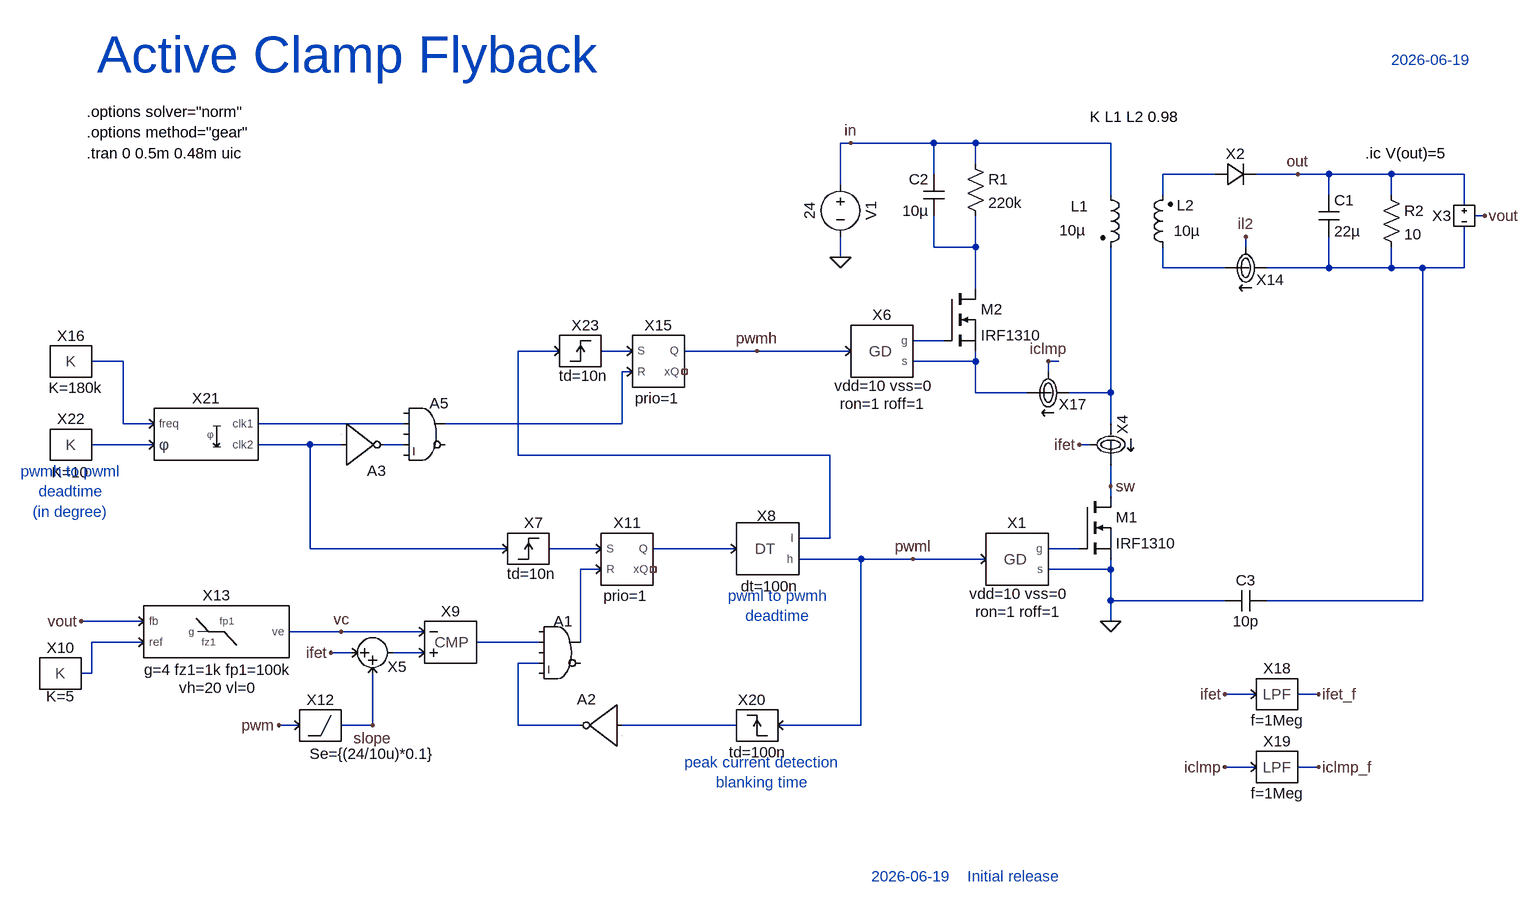
[diagram p0: schematic FLYBACK_ACTIVECLAMP.asc]
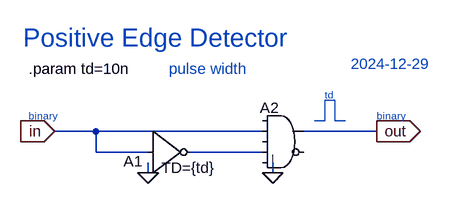
[diagram p1: sub-circuit posedge.asc]
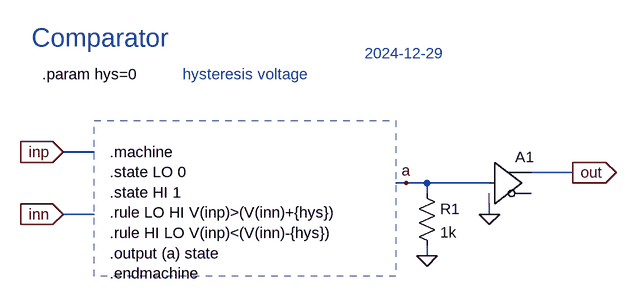
[diagram p2: sub-circuit cmp.asc]
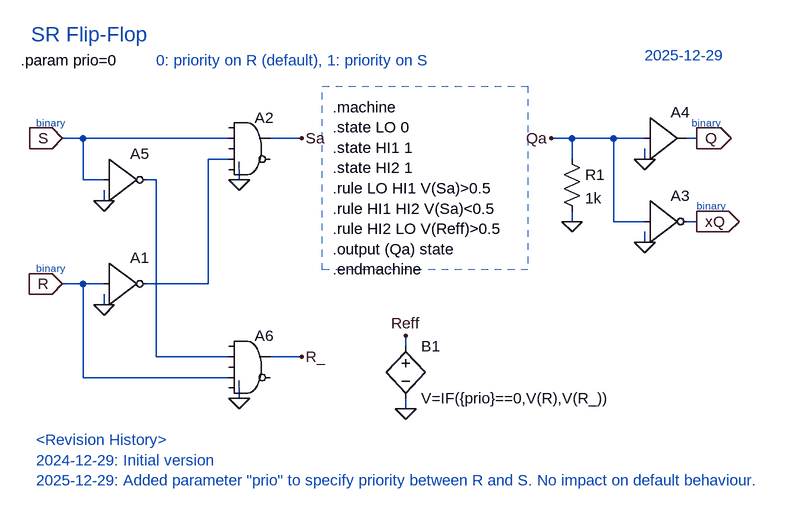
[diagram p3: sub-circuit srff.asc]
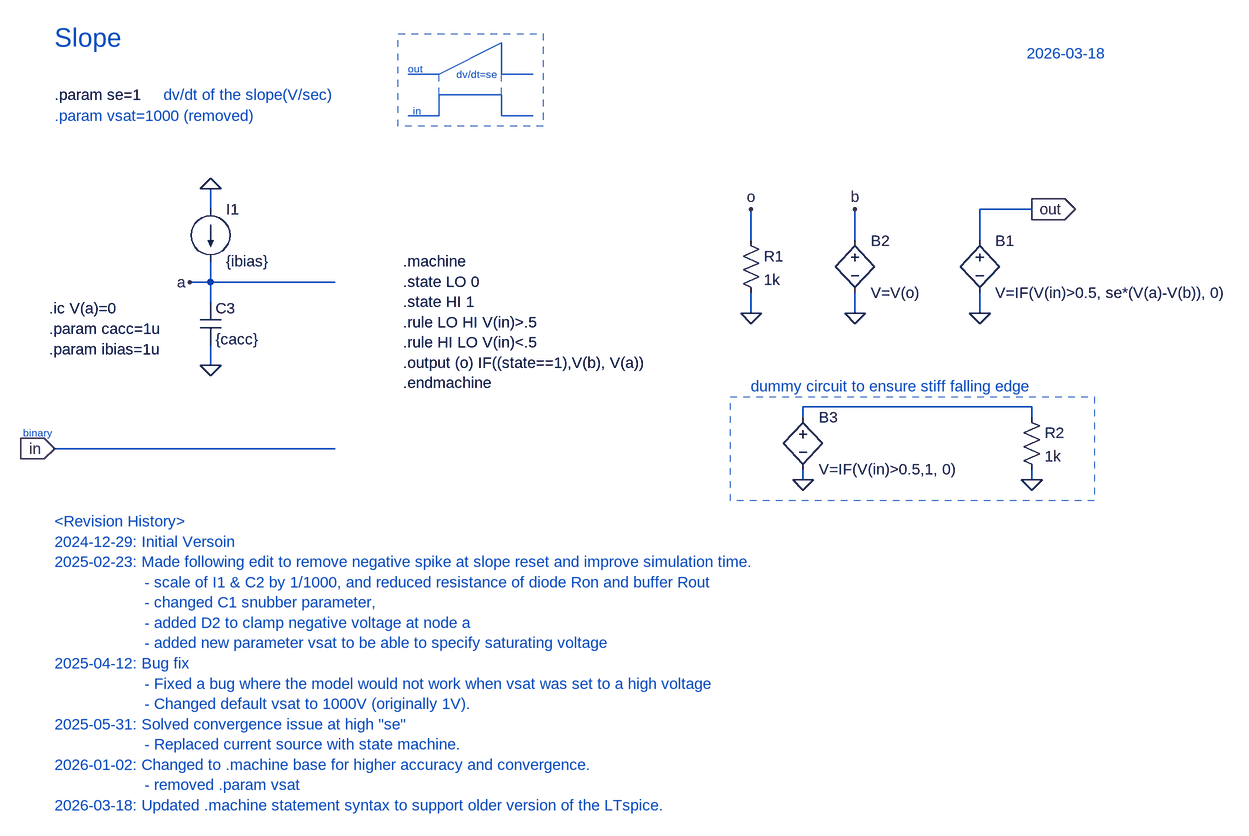
[diagram p4: sub-circuit slope.asc]
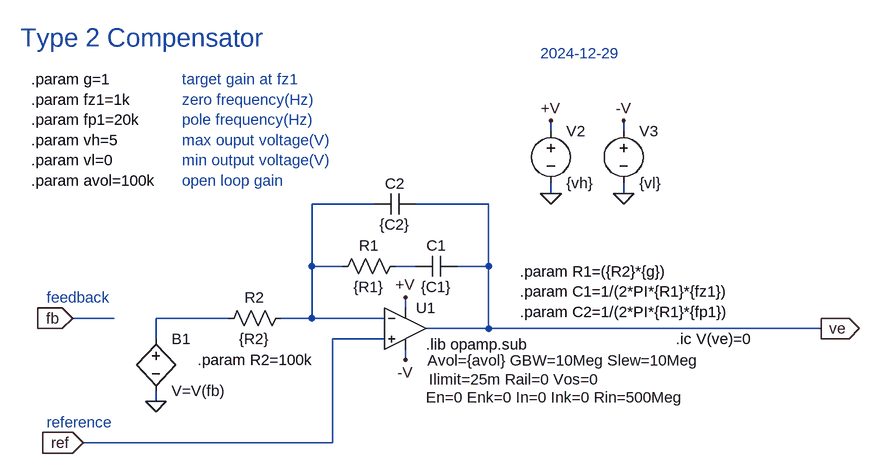
[diagram p5: sub-circuit type2.asc]
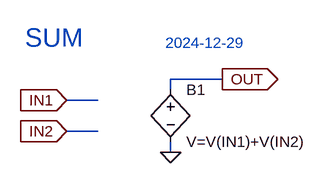
[diagram p6: sub-circuit sum.asc]
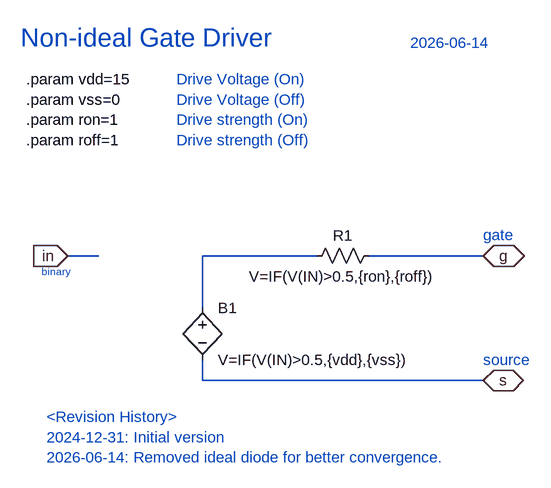
[diagram p7: sub-circuit gd.asc]
FLYBACK_ACTIVECLAMP.asc, the LTspice schematic file:
Version 4.1
SHEET 1 1716 1312
WIRE 608 -352 592 -352
WIRE 736 -352 608 -352
WIRE 800 -352 736 -352
WIRE 1008 -352 800 -352
WIRE 800 -320 800 -352
WIRE 736 -304 736 -352
WIRE 1168 -304 1088 -304
WIRE 1296 -304 1232 -304
WIRE 1344 -304 1296 -304
WIRE 1440 -304 1344 -304
WIRE 1552 -304 1440 -304
WIRE 592 -288 592 -352
WIRE 1008 -272 1008 -352
WIRE 1088 -272 1088 -304
WIRE 1344 -272 1344 -304
WIRE 1440 -272 1440 -304
WIRE 1552 -256 1552 -304
WIRE 1584 -240 1568 -240
WIRE 736 -192 736 -240
WIRE 800 -192 800 -240
WIRE 800 -192 736 -192
WIRE 1216 -192 1216 -208
WIRE 592 -176 592 -208
WIRE 1088 -160 1088 -192
WIRE 1184 -160 1088 -160
WIRE 1344 -160 1344 -208
WIRE 1344 -160 1248 -160
WIRE 1440 -160 1440 -192
WIRE 1440 -160 1344 -160
WIRE 1488 -160 1440 -160
WIRE 1552 -160 1552 -224
WIRE 1552 -160 1488 -160
WIRE 800 -128 800 -192
WIRE 752 -48 704 -48
WIRE 160 -32 96 -32
WIRE 272 -32 224 -32
WIRE 464 -32 352 -32
WIRE 608 -32 464 -32
WIRE -512 -16 -560 -16
WIRE 800 -16 800 -32
WIRE 800 -16 704 -16
WIRE 928 -16 912 -16
WIRE 272 0 256 0
WIRE 912 0 912 -16
WIRE 800 32 800 -16
WIRE 880 32 800 32
WIRE 1008 32 1008 -192
WIRE 1008 32 944 32
WIRE -512 80 -512 -16
WIRE -464 80 -512 80
WIRE -80 80 -304 80
WIRE 256 80 256 0
WIRE 256 80 -16 80
WIRE 1008 80 1008 32
WIRE -464 112 -560 112
WIRE -224 112 -304 112
WIRE -176 112 -224 112
WIRE -80 112 -112 112
WIRE 976 112 960 112
WIRE 96 128 96 -32
WIRE 576 128 96 128
WIRE 1008 176 1008 144
WIRE 1008 192 1008 176
WIRE 576 256 576 128
WIRE 576 256 528 256
WIRE -224 272 -224 112
WIRE 80 272 -224 272
WIRE 224 272 144 272
WIRE 432 272 304 272
WIRE 960 272 912 272
WIRE 624 288 528 288
WIRE 704 288 624 288
WIRE 816 288 704 288
WIRE 224 304 192 304
WIRE 1008 304 1008 288
WIRE 1008 304 912 304
WIRE 1008 352 1008 304
WIRE 1184 352 1008 352
WIRE 1488 352 1488 -160
WIRE 1488 352 1248 352
WIRE -480 384 -576 384
WIRE 1008 384 1008 352
WIRE -176 400 -256 400
WIRE -48 400 -176 400
WIRE -480 416 -560 416
WIRE 128 416 32 416
WIRE 192 416 192 304
WIRE -160 432 -192 432
WIRE -48 432 -96 432
WIRE 128 448 96 448
WIRE -560 464 -560 416
WIRE -560 464 -576 464
WIRE 1232 496 1184 496
WIRE 1328 496 1296 496
WIRE -240 544 -272 544
WIRE -128 544 -128 464
WIRE -128 544 -176 544
WIRE 96 544 96 448
WIRE 192 544 96 544
WIRE 432 544 256 544
WIRE 624 544 624 288
WIRE 624 544 496 544
WIRE 1232 608 1184 608
WIRE 1328 608 1296 608
FLAG 592 -176 0
FLAG 1008 176 sw
FLAG -176 400 vc
FLAG -272 544 pwm
FLAG -128 544 slope
FLAG 608 -352 in
FLAG 1008 384 0
FLAG 960 112 ifet
FLAG 1296 -304 out
FLAG 1584 -240 vout
FLAG -576 384 vout
FLAG -192 432 ifet
FLAG 1216 -208 il2
FLAG 912 -16 iclmp
FLAG 1184 496 ifet
FLAG 1328 496 ifet_f
FLAG 1184 608 iclmp
FLAG 1328 608 iclmp_f
FLAG 464 -32 pwmh
FLAG 704 288 pwml
SYMBOL voltage 592 -304 R0
WINDOW 0 32 56 VTop 2
WINDOW 3 -32 56 VBottom 2
WINDOW 123 0 0 Left 0
WINDOW 39 0 0 Left 0
SYMATTR InstName V1
SYMATTR Value 24
SYMBOL ind2 992 -288 R0
WINDOW 0 -45 33 Left 2
WINDOW 3 -63 70 Left 2
SYMATTR InstName L1
SYMATTR Value 10µ
SYMATTR SpiceLine Rser=10m
SYMATTR Type ind
SYMBOL IMON 1008 112 R90
SYMATTR InstName X4
SYMBOL POSEDGE 112 272 R0
WINDOW 39 5 54 Bottom 2
SYMATTR InstName X7
SYMBOL CMP 0 416 R0
SYMATTR InstName X9
SYMBOL SRFF 256 288 R0
WINDOW 39 6 72 Bottom 2
SYMATTR SpiceLine prio=1
SYMATTR InstName X11
SYMBOL SLOPE -208 544 R0
WINDOW 39 80 59 Bottom 2
SYMATTR SpiceLine Se={(24/10u)*0.1}
SYMATTR InstName X12
SYMBOL TYPE2 -368 400 R0
WINDOW 0 0 -56 Center 2
WINDOW 39 2 58 Center 2
WINDOW 40 2 86 Center 2
SYMATTR InstName X13
SYMATTR SpiceLine g=4 fz1=1k fp1=100k
SYMATTR SpiceLine2 vh=20 vl=0
SYMBOL CONST -608 464 R0
WINDOW 39 0 51 Bottom 2
SYMATTR SpiceLine K=5
SYMATTR InstName X10
SYMBOL SUM -128 432 R0
WINDOW 0 38 37 Bottom 2
SYMATTR InstName X5
SYMBOL PowerSim\\GD 864 288 R0
WINDOW 39 2 69 Bottom 2
WINDOW 40 2 97 Bottom 2
SYMATTR SpiceLine vdd=10 vss=0
SYMATTR InstName X1
SYMBOL nmos 960 192 R0
SYMATTR InstName M1
SYMATTR Value IRF1310
SYMBOL res 784 -336 R0
SYMATTR InstName R1
SYMATTR Value 220k
SYMBOL ind2 1104 -176 R180
WINDOW 0 -33 80 Left 2
WINDOW 3 -42 41 Left 2
SYMATTR InstName L2
SYMATTR Value 10µ
SYMATTR SpiceLine Rser=10m
SYMATTR Type ind
SYMBOL PowerSim\\iD 1200 -304 R270
WINDOW 0 16 0 VTop 2
SYMATTR InstName X2
SYMBOL cap 1328 -272 R0
SYMATTR InstName C1
SYMATTR Value 22µ
SYMATTR SpiceLine Rser=1m
SYMBOL res 1424 -288 R0
SYMATTR InstName R2
SYMATTR Value 10
SYMBOL PowerSim\\VMON 1552 -240 R0
SYMATTR InstName X3
SYMBOL cap 752 -304 M0
SYMATTR InstName C2
SYMATTR Value 10µ
SYMATTR SpiceLine Rser=1m
SYMBOL IMON 1216 -160 R180
SYMATTR InstName X14
SYMBOL cap 1248 336 R90
WINDOW 0 0 32 VBottom 2
WINDOW 3 32 32 VTop 2
SYMATTR InstName C3
SYMATTR Value 10p
SYMBOL PowerSim\\GD 656 -32 R0
WINDOW 39 2 69 Bottom 2
WINDOW 40 2 97 Bottom 2
SYMATTR SpiceLine vdd=10 vss=0
SYMATTR InstName X6
SYMBOL IMON 912 32 R180
SYMATTR InstName X17
SYMBOL PowerSim\\LPF 1264 496 R0
WINDOW 3 1 56 Bottom 2
SYMATTR Value f=1Meg
SYMATTR InstName X18
SYMBOL PowerSim\\LPF 1264 608 R0
WINDOW 3 1 56 Bottom 2
SYMATTR Value f=1Meg
SYMATTR InstName X19
SYMBOL POSEDGE 464 544 M0
WINDOW 39 -1 57 Bottom 2
SYMATTR SpiceLine td=100n
SYMATTR InstName X20
SYMBOL Digital\\and 160 368 R0
WINDOW 0 -9 16 Left 2
SYMATTR InstName A1
SYMBOL Digital\\inv 256 480 M0
SYMATTR InstName A2
SYMBOL nmos 752 -128 R0
SYMATTR InstName M2
SYMATTR Value IRF1310
SYMBOL PowerSim\\DEADTIME 480 272 M180
WINDOW 0 -2 66 Bottom 2
WINDOW 39 3 -42 Bottom 2
SYMATTR InstName X8
SYMATTR SpiceLine dt=100n
SYMBOL PowerSim\\PHASESHIFT2 -384 96 R0
SYMATTR InstName X21
SYMBOL PowerSim\\CONST -592 -16 R0
WINDOW 39 7 56 Bottom 2
SYMATTR SpiceLine K=180k
SYMATTR InstName X16
SYMBOL PowerSim\\CONST -592 112 R0
WINDOW 39 -1 58 Bottom 2
SYMATTR SpiceLine K=10
SYMATTR InstName X22
SYMBOL Digital\\and -48 32 R0
SYMATTR InstName A5
SYMBOL Digital\\inv -176 176 M180
SYMATTR InstName A3
SYMBOL SRFF 304 -16 R0
WINDOW 39 6 72 Bottom 2
SYMATTR SpiceLine prio=1
SYMATTR InstName X15
SYMBOL POSEDGE 192 -32 R0
WINDOW 39 5 54 Bottom 2
SYMATTR InstName X23
TEXT -568 -336 Left 2 !.tran 0 0.5m 0.48m uic
TEXT -552 -488 Left 6 ;Active Clamp Flyback
TEXT 1440 -480 Left 2 ;2026-06-19
TEXT 976 -392 Left 2 !K L1 L2 0.98
TEXT 1400 -336 Left 2 !.ic V(out)=5
TEXT 640 776 Left 2 ;2026-06-19    Initial release
TEXT -568 -400 Left 2 !.options solver="norm"\n.options method="gear"
TEXT 472 616 Center 2 ;peak current detection\nblanking time
TEXT 496 360 Center 2 ;pwml to pwmh\ndeadtime
TEXT -592 184 Center 2 ;pwmh to pwml\ndeadtime\n(in degree)

posedge.asc, the sub-circuit schematic file:
Version 4
SHEET 1 880 680
WIRE 192 160 128 160
WIRE 448 160 192 160
WIRE 624 160 512 160
WIRE 192 192 192 160
WIRE 272 192 192 192
WIRE 448 192 336 192
WIRE 272 224 272 208
WIRE 464 224 464 208
FLAG 128 160 in
IOPIN 128 160 In
FLAG 464 224 0
FLAG 624 160 out
IOPIN 624 160 Out
FLAG 272 224 0
SYMBOL Digital\\and 480 112 R0
WINDOW 0 -36 12 Left 2
SYMATTR InstName A2
SYMBOL Digital\\inv 272 128 R0
WINDOW 3 21 88 Left 2
WINDOW 0 -38 78 Left 2
SYMATTR Value TD={td}
SYMATTR InstName A1
TEXT 88 64 Left 2 !.param td=10n
TEXT 80 16 Left 4 ;Positive Edge Detector
TEXT 88 136 Left 1 ;binary
TEXT 624 136 Left 1 ;binary
TEXT 544 104 Left 1 ;td
TEXT 304 64 Left 2 ;pulse width
TEXT 584 56 Left 2 ;2024-12-29
LINE Normal 544 144 528 144
LINE Normal 544 144 544 112
LINE Normal 560 144 560 112
LINE Normal 576 144 560 144
LINE Normal 544 112 560 112

cmp.asc, the sub-circuit schematic file:
Version 4
SHEET 1 1276 680
WIRE 352 96 304 96
WIRE 1088 128 1024 128
WIRE 832 144 816 144
WIRE 864 144 832 144
WIRE 960 144 864 144
WIRE 864 160 864 144
WIRE 352 192 304 192
WIRE 960 192 960 176
WIRE 864 256 864 240
FLAG 304 96 inp
IOPIN 304 96 In
FLAG 304 192 inn
IOPIN 304 192 In
FLAG 1088 128 out
IOPIN 1088 128 Out
FLAG 864 256 0
FLAG 832 144 a
FLAG 960 192 0
SYMBOL res 848 144 R0
SYMATTR InstName R1
SYMATTR Value 1k
SYMBOL Digital\\buf 960 80 R0
SYMATTR InstName A1
TEXT 376 96 Left 2 !.machine\n.state LO 0\n.state HI 1\n.rule LO HI V(inp)>(V(inn)+{hys})\n.rule HI LO V(inp)<(V(inn)-{hys})\n.output (a) state\n.endmachine
TEXT 272 -24 Left 2 !.param hys=0
TEXT 256 -80 Left 4 ;Comparator
TEXT 488 -24 Left 2 ;hysteresis voltage
TEXT 768 -56 Left 2 ;2024-12-29
RECTANGLE Normal 816 288 352 48 2

srff.asc, the sub-circuit schematic file:
Version 4.1
SHEET 1 928 680
WIRE -272 -496 -304 -496
WIRE -48 -496 -272 -496
WIRE 64 -496 16 -496
WIRE 480 -496 448 -496
WIRE 544 -496 480 -496
WIRE 592 -496 544 -496
WIRE 672 -496 656 -496
WIRE -48 -464 -80 -464
WIRE 480 -464 480 -496
WIRE 592 -464 592 -480
WIRE -272 -432 -272 -496
WIRE -240 -432 -272 -432
WIRE -160 -432 -176 -432
WIRE -32 -432 -32 -448
WIRE -240 -400 -240 -416
WIRE 480 -368 480 -384
WIRE 544 -368 544 -496
WIRE 592 -368 544 -368
WIRE 672 -368 656 -368
WIRE 592 -336 592 -352
WIRE -272 -272 -304 -272
WIRE -240 -272 -272 -272
WIRE -80 -272 -80 -464
WIRE -80 -272 -176 -272
WIRE -240 -240 -240 -256
WIRE 224 -176 224 -192
WIRE -160 -160 -160 -432
WIRE -48 -160 -160 -160
WIRE 64 -160 16 -160
WIRE -272 -128 -272 -272
WIRE -48 -128 -272 -128
WIRE -32 -96 -32 -112
WIRE 224 -80 224 -96
FLAG -304 -496 S
IOPIN -304 -496 In
FLAG -304 -272 R
IOPIN -304 -272 In
FLAG -240 -240 0
FLAG -32 -432 0
FLAG 64 -496 Sa
FLAG 592 -336 0
FLAG 672 -496 Q
IOPIN 672 -496 Out
FLAG 672 -368 xQ
IOPIN 672 -368 Out
FLAG 592 -464 0
FLAG 448 -496 Qa
FLAG 480 -368 0
FLAG 224 -80 0
FLAG 224 -192 Reff
FLAG -240 -400 0
FLAG -32 -96 0
FLAG 64 -160 R_
SYMBOL Digital\\inv -240 -336 R0
SYMATTR InstName A1
SYMBOL Digital\\and -16 -544 R0
SYMATTR InstName A2
SYMBOL Digital\\inv 592 -432 R0
SYMATTR InstName A3
SYMBOL Digital\\buf1 592 -560 R0
SYMATTR InstName A4
SYMBOL res 464 -480 R0
SYMATTR InstName R1
SYMATTR Value 1k
SYMBOL bv 224 -192 R0
SYMATTR InstName B1
SYMATTR Value V=IF({prio}==0,V(R),V(R_))
SYMBOL Digital\\inv -240 -496 R0
SYMATTR InstName A5
SYMBOL Digital\\and -16 -208 R0
SYMATTR InstName A6
TEXT 112 -544 Left 2 !.machine\n.state LO 0\n.state HI1 1\n.state HI2 1\n.rule LO HI1 V(Sa)>0.5\n.rule HI1 HI2 V(Sa)<0.5\n.rule HI2 LO V(Reff)>0.5\n.output (Qa) state\n.endmachine
TEXT -352 -656 Left 3 ;SR Flip-Flop
TEXT -344 -520 Left 1 ;binary
TEXT -344 -296 Left 1 ;binary
TEXT 664 -520 Left 1 ;binary
TEXT 672 -392 Left 1 ;binary
TEXT 592 -624 Left 2 ;2025-12-29
TEXT -368 -616 Left 2 !.param prio=0
TEXT -160 -616 Left 2 ;0: priority on R (default), 1: priority on S
TEXT -344 -32 Left 2 ;<Revision History>\n2024-12-29: Initial version\n2025-12-29: Added parameter "prio" to specify priority between R and S. No impact on default behaviour.
RECTANGLE Normal 412 -294 96 -576 2

slope.asc, the sub-circuit schematic file:
Version 4.1
SHEET 1 2080 1228
WIRE -64 288 -64 256
WIRE 1200 288 1120 288
WIRE 768 336 768 288
WIRE 928 336 928 288
WIRE 1120 336 1120 288
WIRE -64 400 -64 368
WIRE -64 400 -96 400
WIRE 128 400 -64 400
WIRE -64 432 -64 400
WIRE 768 448 768 416
WIRE 928 448 928 416
WIRE 1120 448 1120 416
WIRE -64 528 -64 496
WIRE 1200 592 848 592
WIRE 848 608 848 592
WIRE 1200 608 1200 592
WIRE 128 656 -304 656
WIRE 848 704 848 688
WIRE 1200 704 1200 688
FLAG -304 656 in
IOPIN -304 656 In
FLAG -64 256 0
FLAG -64 528 0
FLAG 1200 288 out
IOPIN 1200 288 Out
FLAG -96 400 a
FLAG 1120 448 0
FLAG 768 448 0
FLAG 768 288 o
FLAG 928 448 0
FLAG 928 288 b
FLAG 1200 704 0
FLAG 848 704 0
SYMBOL current -64 288 R0
SYMATTR InstName I1
SYMATTR Value {ibias}
SYMBOL cap -80 432 R0
SYMATTR InstName C3
SYMATTR Value {cacc}
SYMBOL bv 1120 320 R0
SYMATTR InstName B1
SYMATTR Value V=IF(V(in)>0.5, se*(V(a)-V(b)), 0)
SYMBOL res 752 320 R0
SYMATTR InstName R1
SYMATTR Value 1k
SYMBOL bv 928 320 R0
SYMATTR InstName B2
SYMATTR Value V=V(o)
SYMBOL bv 848 592 R0
SYMATTR InstName B3
SYMATTR Value V=IF(V(in)>0.5,1, 0)
SYMBOL res 1184 592 R0
SYMATTR InstName R2
SYMATTR Value 1k
TEXT -304 112 Left 2 !.param se=1
TEXT -304 24 Left 4 ;Slope
TEXT -352 632 Left 1 ;binary
TEXT -136 112 Left 2 ;dv/dt of the slope(V/sec)
TEXT 248 136 Left 1 ;in
TEXT 240 72 Left 1 ;out
TEXT 376 80 Right 1 ;dv/dt=se
TEXT 1192 48 Left 2 ;2026-03-18
TEXT -304 768 Left 2 ;<Revision History>\n2024-12-29: Initial Versoin\n2025-02-23: Made following edit to remove negative spike at slope reset and improve simulation time.\n                    - scale of I1 & C2 by 1/1000, and reduced resistance of diode Ron and buffer Rout\n                    - changed C1 snubber parameter, \n                    - added D2 to clamp negative voltage at node a \n                    - added new parameter vsat to be able to specify saturating voltage\n2025-04-12: Bug fix \n                    - Fixed a bug where the model would not work when vsat was set to a high voltage \n                    - Changed default vsat to 1000V (originally 1V).\n2025-05-31: Solved convergence issue at high "se" \n                    - Replaced current source with state machine.\n2026-01-02: Changed to .machine base for higher accuracy and convergence.\n                    - removed .param vsat\n2026-03-18: Updated .machine statement syntax to support older version of the LTspice.
TEXT -304 144 Left 2 ;.param vsat=1000 (removed)
TEXT -312 472 Left 2 !.param cacc=1u\n.param ibias=1u
TEXT -312 440 Left 2 !.ic V(a)=0
TEXT 232 368 Left 2 !.machine\n.state LO 0\n.state HI 1\n.rule LO HI V(in)>.5\n.rule HI LO V(in)<.5\n.output (o) IF((state==1),V(b), V(a))\n.endmachine
TEXT 768 560 Left 2 ;dummy circuit to ensure stiff falling edge
LINE Normal 288 144 240 144
LINE Normal 288 144 288 112
LINE Normal 384 112 288 112
LINE Normal 384 144 384 112
LINE Normal 432 144 384 144
LINE Normal 288 80 240 80
LINE Normal 288 80 384 32
LINE Normal 384 80 384 32
LINE Normal 432 80 384 80
LINE Normal 288 112 288 80 1
LINE Normal 384 112 384 80 1
RECTANGLE Normal 448 160 225 18 2
RECTANGLE Normal 1296 736 736 576 2

type2.asc, the sub-circuit schematic file:
Version 4
SHEET 1 1008 680
WIRE 464 -144 464 -160
WIRE 576 -144 576 -160
WIRE 464 -48 464 -64
WIRE 576 -48 576 -64
WIRE 192 -32 96 -32
WIRE 368 -32 256 -32
WIRE 96 64 96 -32
WIRE 144 64 96 64
WIRE 256 64 224 64
WIRE 368 64 368 -32
WIRE 368 64 320 64
WIRE 240 128 240 112
WIRE -208 144 -272 144
WIRE -32 144 -144 144
WIRE 96 144 96 64
WIRE 96 144 48 144
WIRE 208 144 96 144
WIRE 368 160 368 64
WIRE 368 160 272 160
WIRE 880 160 368 160
WIRE -144 176 -144 144
WIRE 208 176 128 176
WIRE 240 208 240 192
WIRE -144 272 -144 256
WIRE 128 336 128 176
WIRE 128 336 -256 336
FLAG -272 144 fb
IOPIN -272 144 In
FLAG -256 336 ref
IOPIN -256 336 In
FLAG -144 272 0
FLAG 880 160 ve
IOPIN 880 160 Out
FLAG 576 -48 0
FLAG 464 -48 0
FLAG 464 -160 +V
FLAG 576 -160 -V
FLAG 240 112 +V
FLAG 240 208 -V
SYMBOL res 240 48 R90
WINDOW 0 0 56 VBottom 2
WINDOW 3 32 56 VTop 2
SYMATTR InstName R1
SYMATTR Value {R1}
SYMBOL cap 320 48 R90
WINDOW 0 0 32 VBottom 2
WINDOW 3 32 32 VTop 2
SYMATTR InstName C1
SYMATTR Value {C1}
SYMBOL cap 256 -48 R90
WINDOW 0 0 32 VBottom 2
WINDOW 3 32 32 VTop 2
SYMATTR InstName C2
SYMATTR Value {C2}
SYMBOL bv -144 160 R0
SYMATTR InstName B1
SYMATTR Value V=V(fb)
SYMBOL res 64 128 R90
WINDOW 0 0 56 VBottom 2
WINDOW 3 32 56 VTop 2
SYMATTR InstName R2
SYMATTR Value {R2}
SYMBOL UniversalOpAmp2 240 160 R0
WINDOW 123 34 49 Left 2
WINDOW 39 36 78 Left 2
WINDOW 40 32 106 Left 2
SYMATTR Value2 Avol={avol} GBW=10Meg Slew=10Meg
SYMATTR InstName U1
SYMBOL voltage 464 -160 R0
SYMATTR InstName V2
SYMATTR Value {vh}
SYMBOL voltage 576 -160 R0
SYMATTR InstName V3
SYMATTR Value {vl}
TEXT 272 184 Left 2 !.lib opamp.sub
TEXT -336 -224 Left 2 !.param g=1\n.param fz1=1k\n.param fp1=20k\n.param vh=5\n.param vl=0\n.param avol=100k
TEXT 416 72 Left 2 !.param R1=({R2}*{g})\n.param C1=1/(2*PI*{R1}*{fz1})\n.param C2=1/(2*PI*{R1}*{fp1})
TEXT -352 -288 Left 4 ;Type 2 Compensator
TEXT -80 208 Left 2 !.param R2=100k
TEXT -104 -224 Left 2 ;target gain at fz1\nzero frequency(Hz)\npole frequency(Hz)\nmax ouput voltage(V)\nmin output voltage(V)\nopen loop gain
TEXT -312 112 Left 2 ;feedback
TEXT -312 304 Left 2 ;reference
TEXT 656 176 Left 2 !.ic V(ve)=0
TEXT 448 -264 Left 2 ;2024-12-29

sum.asc, the sub-circuit schematic file:
Version 4
SHEET 1 880 680
WIRE 288 96 208 96
WIRE 208 112 208 96
WIRE 96 128 48 128
WIRE 96 176 48 176
WIRE 208 208 208 192
FLAG 48 128 IN1
IOPIN 48 128 In
FLAG 48 176 IN2
IOPIN 48 176 In
FLAG 208 208 0
FLAG 288 96 OUT
IOPIN 288 96 Out
SYMBOL bv 208 96 R0
SYMATTR InstName B1
SYMATTR Value V=V(IN1)+V(IN2)
TEXT -16 32 Left 4 ;SUM
TEXT 200 40 Left 2 ;2024-12-29

gd.asc, the sub-circuit schematic file:
Version 4.1
SHEET 1 1232 680
WIRE 64 48 16 48
WIRE 400 48 224 48
WIRE 656 48 480 48
WIRE 224 128 224 48
WIRE 224 240 224 208
WIRE 656 240 224 240
FLAG 16 48 in
IOPIN 16 48 In
FLAG 656 48 g
IOPIN 656 48 BiDir
FLAG 656 240 s
IOPIN 656 240 BiDir
SYMBOL bv 224 112 R0
SYMATTR InstName B1
SYMATTR Value V=IF(V(IN)>0.5,{vdd},{vss})
SYMBOL res 496 32 R90
WINDOW 0 0 56 VBottom 2
WINDOW 3 32 56 VTop 2
SYMATTR InstName R1
SYMATTR Value V=IF(V(IN)>0.5,{ron},{roff})
TEXT -48 -224 Left 2 !.param vdd=15\n.param vss=0\n.param ron=1\n.param roff=1
TEXT -56 -288 Left 4 ;Non-ideal Gate Driver
TEXT 184 -224 Left 2 ;Drive Voltage (On)\nDrive Voltage (Off)\nDrive strength (On)\nDrive strength (Off)
TEXT -24 72 Left 1 ;binary
TEXT 656 16 Left 2 ;gate
TEXT 656 208 Left 2 ;source
TEXT 544 -280 Left 2 ;2026-06-14
TEXT -16 296 Left 2 ;<Revision History>\n2024-12-31: Initial version\n2026-06-14: Removed ideal diode for better convergence.

vmon.asc, the sub-circuit schematic file:
Version 4
SHEET 1 880 680
WIRE 176 -32 80 -32
WIRE -112 0 -112 -32
WIRE 80 0 80 -32
WIRE -112 96 -112 80
WIRE 80 112 80 80
FLAG -112 -32 p
IOPIN -112 -32 BiDir
FLAG -112 96 n
IOPIN -112 96 BiDir
FLAG 176 -32 out
IOPIN 176 -32 Out
FLAG 80 112 0
SYMBOL bv 80 -16 R0
SYMATTR InstName B1
SYMATTR Value V=V(p)-V(n)
SYMBOL current -112 0 R0
WINDOW 123 0 0 Left 0
WINDOW 39 0 0 Left 0
SYMATTR InstName I1
SYMATTR Value 0
TEXT -144 -160 Left 4 ;Voltage Monitor
TEXT -88 -56 Left 2 ;positive
TEXT -88 120 Left 2 ;negative
TEXT 192 -112 Left 2 ;2024-12-29

lpf.asc, the sub-circuit schematic file:
Version 4.1
SHEET 1 1652 804
WIRE 944 -80 848 -80
WIRE 192 -48 80 -48
WIRE 304 -48 272 -48
WIRE 384 -48 304 -48
WIRE 688 -48 464 -48
WIRE 80 -32 80 -48
WIRE 304 -32 304 -48
WIRE 464 -32 464 -48
WIRE 848 -16 848 -80
WIRE -96 0 -160 0
WIRE 304 48 304 32
WIRE 464 64 464 48
WIRE 80 80 80 48
WIRE 848 112 848 64
WIRE 192 288 192 256
WIRE 192 288 128 288
WIRE 256 288 192 288
WIRE 496 288 496 256
WIRE 496 288 432 288
WIRE 560 288 496 288
WIRE 192 320 192 288
WIRE 256 320 256 288
WIRE 432 320 432 288
WIRE 496 320 496 288
WIRE 560 320 560 288
WIRE 128 336 128 288
WIRE 128 480 128 416
WIRE 192 480 192 384
WIRE 256 480 256 400
WIRE 432 480 432 400
WIRE 496 480 496 384
WIRE 560 480 560 400
FLAG -160 0 in
IOPIN -160 0 In
FLAG 944 -80 out
IOPIN 944 -80 Out
FLAG 304 48 0
FLAG 80 80 0
FLAG 384 -48 a
FLAG 464 64 0
FLAG 848 112 0
FLAG 256 480 0
FLAG 192 256 v1
FLAG 496 256 v2
FLAG 128 480 0
FLAG 560 480 0
FLAG 688 -48 v0
FLAG 192 480 0
FLAG 496 480 0
FLAG 432 480 0
SYMBOL res 288 -64 R90
WINDOW 0 0 56 VBottom 2
WINDOW 3 32 56 VTop 2
SYMATTR InstName R1
SYMATTR Value 1k
SYMBOL cap 288 -32 R0
SYMATTR InstName C1
SYMATTR Value {Co}
SYMBOL bv 80 -48 R0
SYMATTR InstName B1
SYMATTR Value V=V(in)
SYMBOL bv 464 -48 R0
SYMATTR InstName B2
SYMATTR Value V=V(a)
SYMBOL bv 848 -32 R0
SYMATTR InstName B3
SYMATTR Value V=IF({n}==1,V(v0),V(v1))
SYMBOL res 240 304 R0
SYMATTR InstName R2
SYMATTR Value 1Gig
SYMBOL cap 176 320 R0
SYMATTR InstName C2
SYMATTR Value 1
SYMBOL bi 128 416 R180
WINDOW 0 24 80 Left 2
WINDOW 3 24 0 Left 2
SYMATTR InstName B5
SYMATTR Value I=V(v2)
SYMBOL res 448 304 M0
SYMATTR InstName R3
SYMATTR Value 1Gig
SYMBOL cap 512 320 M0
SYMATTR InstName C3
SYMATTR Value 1
SYMBOL bi 560 400 R180
WINDOW 3 -848 -5 Left 2
WINDOW 0 -56 82 Left 2
SYMATTR Value I={-(2*pi*f)*(2*pi*f)*V(v1)-(2*pi*f/q)*V(v2)+(2*pi*f)*(2*pi*f)*V(in)}
SYMATTR InstName B4
TEXT -264 -368 Left 4 ;1st/2nd order Low Pass Filter
TEXT 696 -368 Left 2 ;2025-12-26
TEXT -256 -304 Left 2 !.param f=100k\n.param n=1\n.param q=0.5
TEXT 328 -80 Left 2 !.param Co=1/({f}*2k*PI)
TEXT 0 -304 Left 2 ;cut off frequency\nfilter order (1:1st order, other: 2nd order)\nq factor (only for 2nd order)
TEXT -8 -112 Left 2 ;1st Order LPF
TEXT 8 160 Left 2 ;2nd Order LPF
TEXT -152 560 Left 2 ;<Revision History>\n2025-03-23: Initial version\n2025-12-26: \n -  Replaced LTspice built in 2ndOrderLPF with discrete circuit to improve convergence.\n -  Removed output MUX and replaced it with BV.
RECTANGLE Normal 752 112 -16 -96 2
RECTANGLE Normal 1440 512 -16 192 2

deadtime.asc, the sub-circuit schematic file:
Version 4
SHEET 1 1412 1312
WIRE 64 288 -16 288
WIRE 208 288 128 288
WIRE 64 320 64 304
WIRE 208 352 208 288
WIRE 304 352 208 352
WIRE 368 352 304 352
WIRE 528 352 432 352
WIRE -16 384 -16 288
WIRE -16 384 -96 384
WIRE 64 384 -16 384
WIRE 240 384 128 384
WIRE 368 384 240 384
WIRE 64 416 64 400
WIRE 384 416 384 400
WIRE 304 496 304 352
WIRE 368 496 304 496
WIRE 240 528 240 384
WIRE 368 528 240 528
WIRE 528 528 432 528
WIRE 384 560 384 544
FLAG -96 384 in
IOPIN -96 384 In
FLAG 64 416 0
FLAG 64 320 0
FLAG 384 416 0
FLAG 384 560 0
FLAG 528 352 h
IOPIN 528 352 Out
FLAG 528 528 l
IOPIN 528 528 Out
SYMBOL Digital\\buf1 64 320 R0
SYMATTR InstName A1
SYMBOL Digital\\buf1 64 224 R0
WINDOW 3 54 42 Left 2
SYMATTR Value TD={dt}
SYMATTR InstName A2
SYMBOL Digital\\and 400 304 R0
SYMATTR InstName A3
SYMBOL Digital\\or 400 448 R0
SYMATTR InstName A4
TEXT -176 144 Left 2 !.param dt=10n
TEXT -184 96 Left 4 ;Deadtime Generator
TEXT 24 144 Left 2 ;deadtime(sec)
TEXT 512 320 Left 2 ;hi-side
TEXT 520 496 Left 2 ;lo-side
TEXT 328 160 Left 2 ;in
TEXT 328 208 Left 2 ;h
TEXT 328 256 Left 2 ;l
TEXT 400 184 Left 1 ;dt
TEXT 512 184 Left 1 ;dt
TEXT 456 104 Left 2 ;2024-12-29
LINE Normal 400 176 336 176
LINE Normal 400 176 400 144
LINE Normal 528 144 400 144
LINE Normal 528 176 528 144
LINE Normal 592 176 528 176
LINE Normal 416 224 336 224
LINE Normal 416 224 416 192
LINE Normal 528 192 416 192
LINE Normal 528 224 528 192
LINE Normal 592 224 528 224
LINE Normal 400 240 336 240
LINE Normal 400 272 400 240
LINE Normal 512 272 400 272
LINE Normal 512 272 512 240
LINE Normal 592 240 512 240
LINE Normal 400 240 400 176 2
LINE Normal 512 240 512 176 2
LINE Normal 416 240 416 176 2
LINE Normal 528 240 528 176 2
RECTANGLE Normal 608 288 304 128 2

phaseshift2.asc, the sub-circuit schematic file:
Version 4
SHEET 1 1572 1312
WIRE -128 -112 -224 -112
WIRE -224 -80 -224 -112
WIRE -960 -64 -992 -64
WIRE -128 -32 -128 -112
WIRE -224 32 -224 0
WIRE -128 128 -128 48
WIRE -80 128 -128 128
WIRE 16 128 -80 128
WIRE 96 128 16 128
WIRE 256 128 256 112
WIRE 336 128 256 128
WIRE 16 144 16 128
WIRE 256 144 256 128
WIRE 480 144 400 144
WIRE 336 176 336 160
WIRE -944 192 -976 192
WIRE -128 208 -128 128
WIRE 16 240 16 208
WIRE 256 256 256 224
WIRE -128 320 -128 288
WIRE -928 496 -928 480
WIRE -928 592 -928 576
WIRE 480 624 400 624
WIRE 256 640 256 624
WIRE 336 640 256 640
WIRE 256 656 256 640
WIRE -928 688 -928 672
WIRE 336 688 336 672
WIRE 256 768 256 736
WIRE -928 784 -928 768
FLAG -992 -64 freq
IOPIN -992 -64 In
FLAG 16 240 0
FLAG -224 32 0
FLAG -976 192 phase
IOPIN -976 192 In
FLAG -128 320 0
FLAG 256 256 0
FLAG -80 128 a
FLAG -928 592 0
FLAG -928 480 d
FLAG 480 144 clk1
IOPIN 480 144 Out
FLAG 336 176 0
FLAG 256 112 b
FLAG 256 768 0
FLAG 480 624 clk2
IOPIN 480 624 Out
FLAG 336 688 0
FLAG 256 624 c
FLAG -928 784 0
FLAG -928 672 ph
SYMBOL cap 0 144 R0
SYMATTR InstName C1
SYMATTR Value 0.5
SYMBOL voltage -224 -96 R0
WINDOW 123 0 0 Left 0
WINDOW 39 0 0 Left 0
SYMATTR InstName V2
SYMATTR Value 2
SYMBOL bi -128 -32 R0
SYMATTR InstName B1
SYMATTR Value I=IF(V(b),0,V(freq))
SYMBOL bi -128 208 R0
SYMATTR InstName B2
SYMATTR Value I=IF(V(b),V(freq),0)
SYMBOL res 240 128 R0
SYMATTR InstName R2
SYMATTR Value 1k
SYMBOL bv -928 480 R0
SYMATTR InstName B3
SYMATTR Value V=IF(V(phase)>180,180,V(phase))
SYMBOL Digital\\buf 336 64 R0
SYMATTR InstName A1
SYMBOL res 240 640 R0
SYMATTR InstName R1
SYMATTR Value 1k
SYMBOL Digital\\buf 336 576 R0
SYMATTR InstName A3
SYMBOL bv -928 672 R0
SYMATTR InstName B4
SYMATTR Value V=IF(V(d)<-180,-180,V(d))/180+1n
TEXT -520 32 Left 2 !.machine\n.state LO 0\n.state HI 1\n.rule LO HI V(a)>(1+1n)\n.rule HI LO V(a)<1n\n.output (b) state\n.endmachine
TEXT 24 96 Left 2 !.ic V(a)=0
TEXT -320 448 Left 2 !.machine\n.state LO0a 0\n.state LO0b 0\n.state LO1a 0\n.state LO1b 0\n.state HI0a 1\n.state HI0b 1\n.state HI1a 1\n.state HI1b 1\n.rule LO0a LO1a V(ph)>=0\n.rule LO1a LO0a V(ph)<0\n.rule LO1a LO1b V(a)<1n\n.rule LO1b HI1a V(a)>V(ph)\n.rule HI1a HI1b V(a)>1+1n\n.rule HI1b LO1a V(a)<(1-V(ph))\n.rule LO0a LO0b V(a)>1+1n\n.rule LO0b HI0a V(a)<abs(V(ph))\n.rule HI0a HI0b V(a)<1n\n.rule HI0b LO0a V(a)>(1-abs(V(ph)))\n.output (c) state\n.endmachine
TEXT 232 440 Left 2 !.ic V(clk1)=0 V(clk2)=0
TEXT -1072 -208 Left 4 ;Frequency Variable Phase Modulator
TEXT -1064 -104 Left 2 ;Frequency(Hz)
TEXT -1064 152 Left 2 ;Phase(°)
TEXT -104 -184 Left 2 ;2024-12-29

The netlist it stands for:
* FLYBACK_ACTIVECLAMP.asc
V1 in 0 24
L1 in N011 10µ Rser=10m
X§X4 sw ifet N011 IMON rsns=10u  ; pins n out p
X§X7 N014 N016 posedge params: td=10n
X§X9 vc N022 N021 cmp params: hys=0
X§X11 N019 N016 N017 NC_01 srff params: prio=1
X§X12 pwm slope slope params: Se={(24/10u)*0.1}
X§X13 vout N020 vc type2 params: avol=100k g=4 fz1=1k fp1=100k vh=20 vl=0
X§X10 N020 CONST K=5  ; pins K
X§X5 ifet slope N022 sum
X§X1 pwml N018 0 gd params: vdd=10 vss=0 ron=1 roff=1
M1 sw N018 0 0 IRF1310
R1 in N002 220k
L2 N003 N001 10µ Rser=10m
X§X2 N001 out iD params: von=1n ron=10m esl=1f rsnb=1k csnb=10p  ; pins AN CA
C1 out N004 22µ Rser=1m
R2 out N004 10
X§X3 N004 vout out vmon
C2 in N002 10µ Rser=1m
X§X14 N003 il2 N004 IMON rsns=10u  ; pins n out p
C3 N004 0 10p
X§X6 pwmh N005 N009 gd params: vdd=10 vss=0 ron=1 roff=1
X§X17 N009 iclmp N011 IMON rsns=10u  ; pins n out p
X§X18 ifet ifet_f lpf params: f=1Meg n=1 q=0.5
X§X19 iclmp iclmp_f lpf params: f=1Meg n=1 q=0.5
X§X20 pwml N024 posedge params: td=100n
A1 0 N021 0 N023 0 0 N019 0 AND
A2 N024 0 0 0 0 N023 0 0 BUF
M2 N002 N005 N009 N009 IRF1310
X§X8 N017 N006 pwml deadtime params: dt=100n
X§X21 N008 N013 N012 N014 phaseshift2
X§X16 N008 CONST K=180k  ; pins K
X§X22 N013 CONST K=10  ; pins K
A5 0 N012 0 N015 0 0 N010 0 AND
A3 N014 0 0 0 0 N015 0 0 BUF
X§X15 N010 N007 pwmh NC_02 srff params: prio=1
X§X23 N006 N007 posedge params: td=10n

* block symbol definitions
.subckt posedge in out
A2 0 in 0 N001 0 0 out 0 AND
A1 in 0 0 0 0 N001 0 0 BUF TD={td}
.param td=10n
* Positive Edge Detector
* binary
* binary
* td
* pulse width
* 2024-12-29
.ends posedge

.subckt cmp inn inp out
R1 a 0 1k
A1 a 0 0 0 0 0 out 0 BUF
.machine
.state LO 0
.state HI 1
.rule LO HI V(inp)>(V(inn)+{hys})
.rule HI LO V(inp)<(V(inn)-{hys})
.output (a) state
.endmachine
.param hys=0
* Comparator
* hysteresis voltage
* 2024-12-29
.ends cmp

.subckt srff R S Q xQ
A1 R 0 0 0 0 N001 0 0 BUF
A2 0 S 0 N001 0 0 Sa 0 AND
A3 Qa 0 0 0 0 xQ 0 0 BUF
A4 Qa 0 0 0 0 0 Q 0 BUF
R1 Qa 0 1k
B1 Reff 0 V=IF({prio}==0,V(R),V(R_))
A5 S 0 0 0 0 N002 0 0 BUF
A6 0 N002 0 R 0 0 R_ 0 AND
.machine
.state LO 0
.state HI1 1
.state HI2 1
.rule LO HI1 V(Sa)>0.5
.rule HI1 HI2 V(Sa)<0.5
.rule HI2 LO V(Reff)>0.5
.output (Qa) state
.endmachine
* SR Flip-Flop
* binary
* binary
* binary
* binary
* 2025-12-29
.param prio=0
* 0: priority on R (default), 1: priority on S
* <Revision History>
* 2024-12-29: Initial version
* 2025-12-29: Added parameter "prio" to specify priority between R and S. No impact on default behaviour.
.ends srff

.subckt slope in out
I1 0 a {ibias}
C3 a 0 {cacc}
B1 out 0 V=IF(V(in)>0.5, se*(V(a)-V(b)), 0)
R1 o 0 1k
B2 b 0 V=V(o)
B3 N001 0 V=IF(V(in)>0.5,1, 0)
R2 N001 0 1k
.param se=1
* Slope
* binary
* dv/dt of the slope(V/sec)
* in
* out
* dv/dt=se
* 2026-03-18
* <Revision History>
* 2024-12-29: Initial Versoin
* 2025-02-23: Made following edit to remove negative spike at slope reset and improve simulation time.
*                     - scale of I1 & C2 by 1/1000, and reduced resistance of diode Ron and buffer Rout
*                     - changed C1 snubber parameter,
*                     - added D2 to clamp negative voltage at node a
*                     - added new parameter vsat to be able to specify saturating voltage
* 2025-04-12: Bug fix
*                     - Fixed a bug where the model would not work when vsat was set to a high voltage
*                     - Changed default vsat to 1000V (originally 1V).
* 2025-05-31: Solved convergence issue at high "se"
*                     - Replaced current source with state machine.
* 2026-01-02: Changed to .machine base for higher accuracy and convergence.
*                     - removed .param vsat
* 2026-03-18: Updated .machine statement syntax to support older version of the LTspice.
* .param vsat=1000 (removed)
.param cacc=1u
.param ibias=1u
.ic V(a)=0
.machine
.state LO 0
.state HI 1
.rule LO HI V(in)>.5
.rule HI LO V(in)<.5
.output (o) IF((state==1),V(b), V(a))
.endmachine
* dummy circuit to ensure stiff falling edge
.ends slope

.subckt type2 fb ref ve
R1 N002 N001 {R1}
C1 ve N002 {C1}
C2 ve N001 {C2}
B1 N003 0 V=V(fb)
R2 N001 N003 {R2}
XU1 ref N001 +V -V ve level2 Avol={avol} GBW=10Meg Slew=10Meg Ilimit=25m Rail=0 Vos=0 En=0 Enk=0 In=0 Ink=0 Rin=500Meg  ; pins In+ In- V+ V- OUT
V2 +V 0 {vh}
V3 -V 0 {vl}
.lib opamp.sub
.param g=1
.param fz1=1k
.param fp1=20k
.param vh=5
.param vl=0
.param avol=100k
.param R1=({R2}*{g})
.param C1=1/(2*PI*{R1}*{fz1})
.param C2=1/(2*PI*{R1}*{fp1})
* Type 2 Compensator
.param R2=100k
* target gain at fz1
* zero frequency(Hz)
* pole frequency(Hz)
* max ouput voltage(V)
* min output voltage(V)
* open loop gain
* feedback
* reference
.ic V(ve)=0
* 2024-12-29
.ends type2

.subckt sum in1 in2 out
B1 OUT 0 V=V(IN1)+V(IN2)
* SUM
* 2024-12-29
.ends sum

.subckt gd in g s
B1 N001 s V=IF(V(IN)>0.5,{vdd},{vss})
R1 g N001 V=IF(V(IN)>0.5,{ron},{roff})
.param vdd=15
.param vss=0
.param ron=1
.param roff=1
* Non-ideal Gate Driver
* Drive Voltage (On)
* Drive Voltage (Off)
* Drive strength (On)
* Drive strength (Off)
* binary
* gate
* source
* 2026-06-14
* <Revision History>
* 2024-12-31: Initial version
* 2026-06-14: Removed ideal diode for better convergence.
.ends gd

.subckt vmon n out p
B1 out 0 V=V(p)-V(n)
I1 p n 0
* Voltage Monitor
* positive
* negative
* 2024-12-29
.ends vmon

.subckt lpf in out
R1 a N001 1k
C1 a 0 {Co}
B1 N001 0 V=V(in)
B2 v0 0 V=V(a)
B3 out 0 V=IF({n}==1,V(v0),V(v1))
R2 v1 0 1Gig
C2 v1 0 1
B5 0 v1 I=V(v2)
R3 v2 0 1Gig
C3 v2 0 1
B4 0 v2 I={-(2*pi*f)*(2*pi*f)*V(v1)-(2*pi*f/q)*V(v2)+(2*pi*f)*(2*pi*f)*V(in)}
* 1st/2nd order Low Pass Filter
* 2025-12-26
.param f=100k
.param n=1
.param q=0.5
.param Co=1/({f}*2k*PI)
* cut off frequency
* filter order (1:1st order, other: 2nd order)
* q factor (only for 2nd order)
* 1st Order LPF
* 2nd Order LPF
* <Revision History>
* 2025-03-23: Initial version
* 2025-12-26:
*  -  Replaced LTspice built in 2ndOrderLPF with discrete circuit to improve convergence.
*  -  Removed output MUX and replaced it with BV.
.ends lpf

.subckt deadtime in l h
A1 in 0 0 0 0 0 N002 0 BUF
A2 in 0 0 0 0 0 N001 0 BUF TD={dt}
A3 0 N001 0 N002 0 0 h 0 AND
A4 0 N001 0 N002 0 l 0 0 OR
.param dt=10n
* Deadtime Generator
* deadtime(sec)
* hi-side
* lo-side
* in
* h
* l
* dt
* dt
* 2024-12-29
.ends deadtime

.subckt phaseshift2 freq phase clk1 clk2
C1 a 0 0.5
V2 N001 0 2
B1 N001 a I=IF(V(b),0,V(freq))
B2 a 0 I=IF(V(b),V(freq),0)
R2 b 0 1k
B3 d 0 V=IF(V(phase)>180,180,V(phase))
A1 b 0 0 0 0 clk1 0 0 BUF
R1 c 0 1k
A3 c 0 0 0 0 0 clk2 0 BUF
B4 ph 0 V=IF(V(d)<-180,-180,V(d))/180+1n
.machine
.state LO 0
.state HI 1
.rule LO HI V(a)>(1+1n)
.rule HI LO V(a)<1n
.output (b) state
.endmachine
.ic V(a)=0
.machine
.state LO0a 0
.state LO0b 0
.state LO1a 0
.state LO1b 0
.state HI0a 1
.state HI0b 1
.state HI1a 1
.state HI1b 1
.rule LO0a LO1a V(ph)>=0
.rule LO1a LO0a V(ph)<0
.rule LO1a LO1b V(a)<1n
.rule LO1b HI1a V(a)>V(ph)
.rule HI1a HI1b V(a)>1+1n
.rule HI1b LO1a V(a)<(1-V(ph))
.rule LO0a LO0b V(a)>1+1n
.rule LO0b HI0a V(a)<abs(V(ph))
.rule HI0a HI0b V(a)<1n
.rule HI0b LO0a V(a)>(1-abs(V(ph)))
.output (c) state
.endmachine
.ic V(clk1)=0 V(clk2)=0
* Frequency Variable Phase Modulator
* Frequency(Hz)
* Phase(°)
* 2024-12-29
.ends phaseshift2

.model NMOS NMOS
.model PMOS PMOS
.lib standard.mos
.tran 0 0.5m 0.48m uic
* Active Clamp Flyback
* 2026-06-19
K L1 L2 0.98
.ic V(out)=5
* 2026-06-19    Initial release
.options solver="norm"
.options method="gear"
* peak current detection
* blanking time
* pwml to pwmh
* deadtime
* pwmh to pwml
* deadtime
* (in degree)
.lib UniversalOpAmp2.lib
.backanno
.end